# EAGLE schematic Octal (EAGLE 9.4.1)

## Sheet 1 of 6
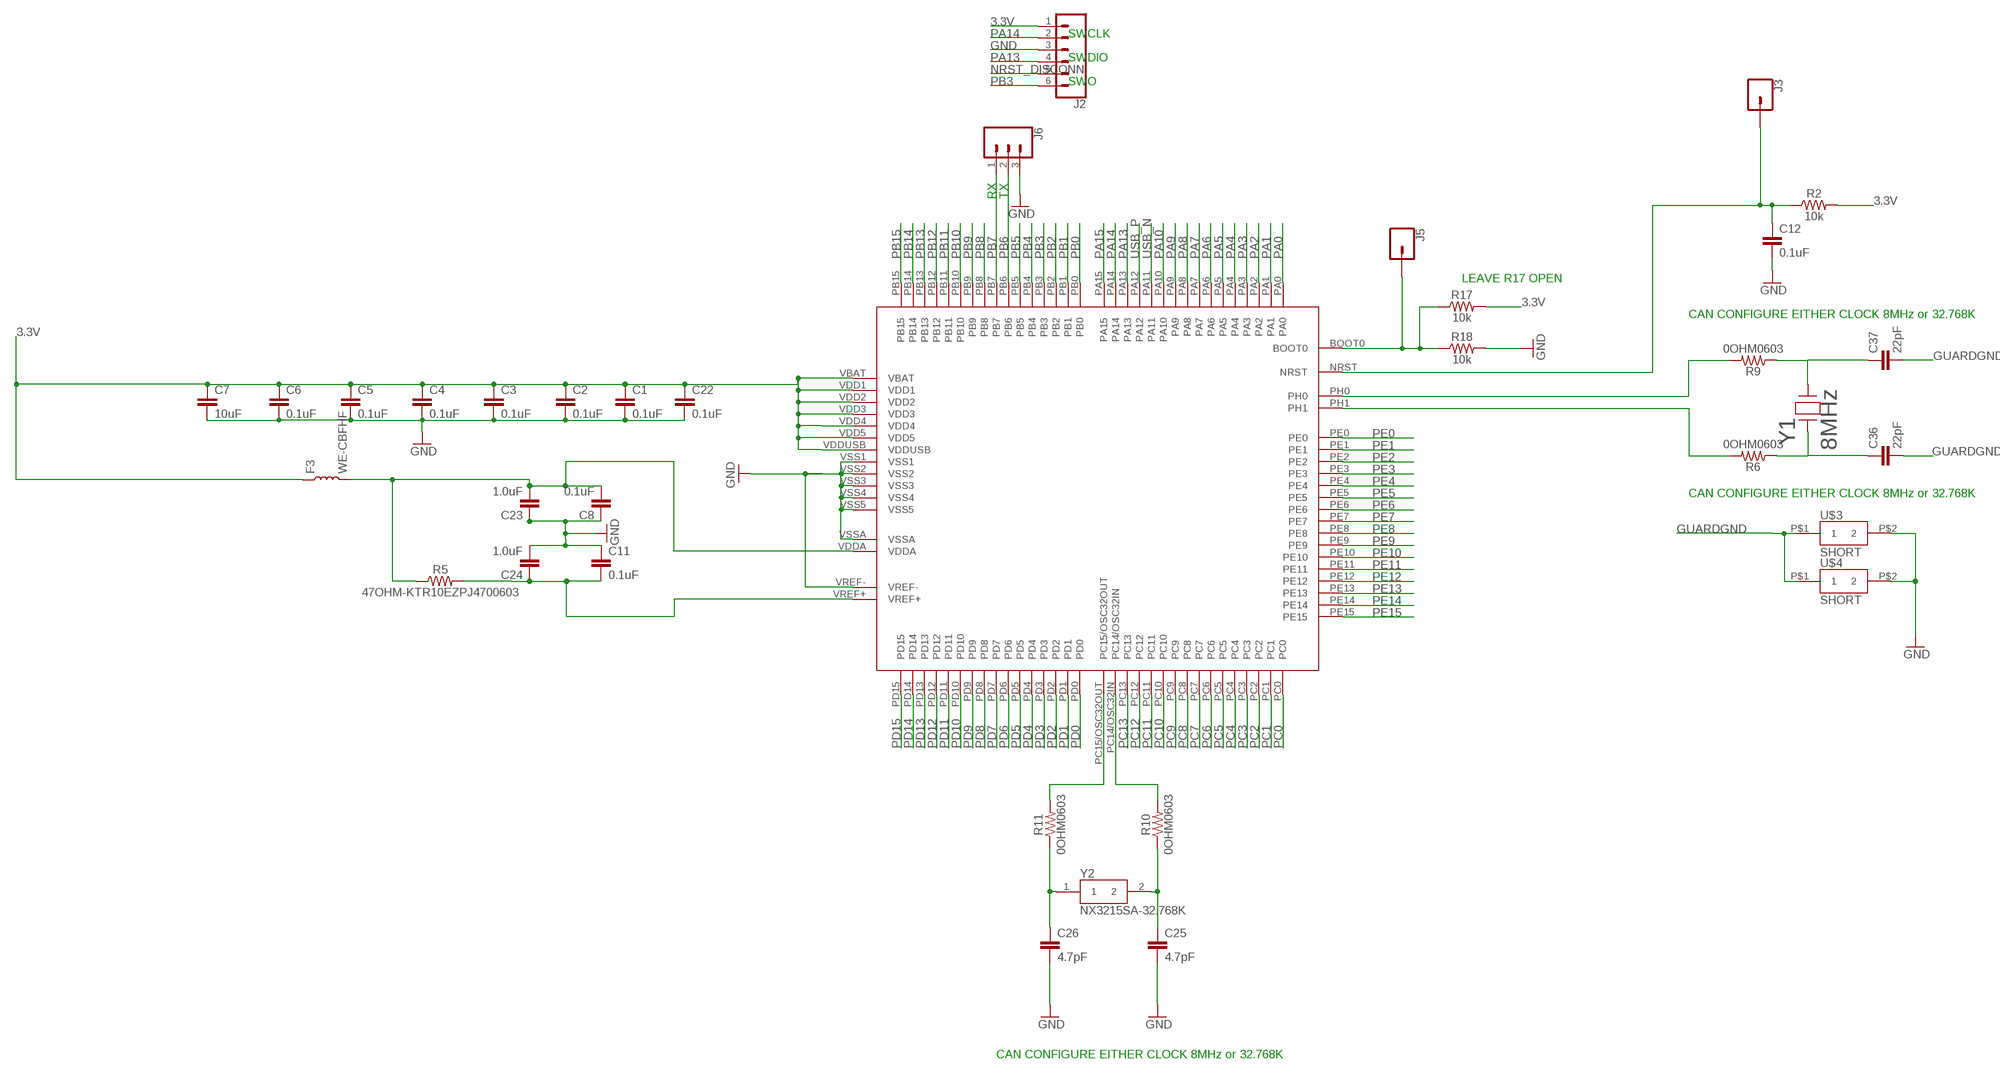
[diagram p0: schematic, sheet 1]

### Parts
C1  0.1uF  0.1UF-0603-25V-5%  [0603]
C2  0.1uF  0.1UF-0603-25V-5%  [0603]
C3  0.1uF  0.1UF-0603-25V-5%  [0603]
C4  0.1uF  0.1UF-0603-25V-5%  [0603]
C5  0.1uF  0.1UF-0603-25V-5%  [0603]
C6  0.1uF  0.1UF-0603-25V-5%  [0603]
C7  10uF  10UF-0603-6.3V-20%  [0603]
C8  0.1uF  0.1UF-0603-25V-5%  [0603]
C11  0.1uF  0.1UF-0603-25V-5%  [0603]
C12  0.1uF  0.1UF-0603-25V-5%  [0603]
C22  0.1uF  0.1UF-0603-25V-5%  [0603]
C23  1.0uF  1.0UF-0603-16V-10%  [0603]
C24  1.0uF  1.0UF-0603-16V-10%  [0603]
C25  4.7pF  22PF-0603-50V-5%  [0603]
C26  4.7pF  22PF-0603-50V-5%  [0603]
C36  22pF  22PF-0603-50V-5%  [0603]
C37  22pF  22PF-0603-50V-5%  [0603]
F3  WE-CBFHF  [0603]
J2  CONN_06SILK_FEMALE_PTH  [1X06]
J3  CONN_01  [1X01]
J5  CONN_01  [1X01]
J6  CONN_03  [1X03]
R2  10k  10KOHM-0603-1/10W-1%  [0603]
R5  47OHM-KTR10EZPJ4700603  [0603]
R6  0OHM0603  [0603]
R9  0OHM0603  [0603]
R10  0OHM0603  [0603]
R11  0OHM0603  [0603]
R17  10k  10KOHM-0603-1/10W-1%  [0603]
R18  10k  10KOHM-0603-1/10W-1%  [0603]
U5  STM32L476VGT6  [STM32L4_LQFP100]
U$3  SHORT  [SHORT]
U$4  SHORT  [SHORT]
Y1  8MHz  FOXSDLF/080-20  [CRYSTAL_HC49SDLF]
Y2  NX3215SA-32.768K  NX3215SA-32.768K-EXS00A-MU0000  [NX3215SA32768KEXS00AMU00003]

### Nets
3.3V: C1.1 C2.1 C3.1 C4.1 C5.1 C6.1 C7.1 C22.1 F3.1 J2.1 R2.2 R17.2 U5.VBAT U5.VDD1 U5.VDD2 U5.VDD3 U5.VDD4 U5.VDD5 U5.VDDUSB ; also sheet 2,3,4,5,6
BOOT0: J5.1 R17.1 R18.1 U5.BOOT0
GND [ground]: C1.2 C2.2 C3.2 C4.2 C5.2 C6.2 C7.2 C8.1 C11.1 C12.2 C22.2 C23.1 C24.2 C25.2 C26.2 J2.3 J6.3 R18.2 U5.VREF- U5.VSS1 U5.VSS2 U5.VSS3 U5.VSS4 U5.VSS5 U5.VSSA U$3.P$2 U$4.P$2 ; also sheet 2,3,4,5
GUARDGND: C36.2 C37.2 U$3.P$1 U$4.P$1
N$1: C8.2 C23.2 F3.2 R5.1 U5.VDDA
N$2 [ground]: C11.2 C24.1 R5.2 U5.VREF+
N$8: R9.2 U5.PH0
N$13: C37.1 R9.1 Y1.2
N$14: C36.1 R6.1 Y1.1
N$17: R6.2 U5.PH1
N$18: C26.1 R11.1 Y2.1
N$19: C25.1 R10.1 Y2.2
N$20: R11.2 U5.PC15/OSC32OUT
N$21: R10.2 U5.PC14/OSC32IN
NRST1: C12.1 J3.1 R2.1 U5.NRST
NRST_DISCONN: J2.5
PA0: U5.PA0 ; also sheet 6
PA1: U5.PA1 ; also sheet 6
PA2: U5.PA2 ; also sheet 6
PA3: U5.PA3 ; also sheet 6
PA4: U5.PA4 ; also sheet 6
PA5: U5.PA5 ; also sheet 6
PA6: U5.PA6 ; also sheet 6
PA7: U5.PA7 ; also sheet 6
PA8: U5.PA8 ; also sheet 6
PA9: U5.PA9 ; also sheet 6
PA10: U5.PA10 ; also sheet 6
PA13: J2.4 U5.PA13
PA14: J2.2 U5.PA14
PA15: U5.PA15 ; also sheet 6
PB0: U5.PB0 ; also sheet 6
PB1: U5.PB1 ; also sheet 6
PB2: U5.PB2 ; also sheet 6
PB3: J2.6 U5.PB3
PB4: U5.PB4 ; also sheet 4
PB5: U5.PB5
PB6: J6.2 U5.PB6
PB7: J6.1 U5.PB7
PB8: U5.PB8
PB9: U5.PB9
PB10: U5.PB10 ; also sheet 5
PB11: U5.PB11 ; also sheet 5
PB12: U5.PB12 ; also sheet 6
PB13: U5.PB13 ; also sheet 6
PB14: U5.PB14 ; also sheet 5
PB15: U5.PB15 ; also sheet 5
PC0: U5.PC0 ; also sheet 6
PC1: U5.PC1 ; also sheet 6
PC2: U5.PC2 ; also sheet 6
PC3: U5.PC3 ; also sheet 6
PC4: U5.PC4 ; also sheet 6
PC5: U5.PC5 ; also sheet 6
PC6: U5.PC6 ; also sheet 6
PC7: U5.PC7 ; also sheet 6
PC8: U5.PC8 ; also sheet 6
PC9: U5.PC9 ; also sheet 6
PC10: U5.PC10 ; also sheet 6
PC11: U5.PC11 ; also sheet 4
PC12: U5.PC12 ; also sheet 6
PC13: U5.PC13
PD0: U5.PD0 ; also sheet 6
PD1: U5.PD1 ; also sheet 6
PD2: U5.PD2 ; also sheet 6
PD3: U5.PD3 ; also sheet 6
PD4: U5.PD4 ; also sheet 6
PD5: U5.PD5 ; also sheet 6
PD6: U5.PD6 ; also sheet 6
PD7: U5.PD7 ; also sheet 6
PD8: U5.PD8 ; also sheet 6
PD9: U5.PD9 ; also sheet 6
PD10: U5.PD10 ; also sheet 6
PD11: U5.PD11 ; also sheet 3
PD12: U5.PD12 ; also sheet 6
PD13: U5.PD13 ; also sheet 6
PD14: U5.PD14 ; also sheet 6
PD15: U5.PD15 ; also sheet 6
PE0: U5.PE0 ; also sheet 4
PE1: U5.PE1 ; also sheet 5
PE2: U5.PE2 ; also sheet 6
PE3: U5.PE3 ; also sheet 6
PE4: U5.PE4 ; also sheet 6
PE5: U5.PE5 ; also sheet 6
PE6: U5.PE6 ; also sheet 6
PE7: U5.PE7 ; also sheet 6
PE8: U5.PE8 ; also sheet 5
PE9: U5.PE9 ; also sheet 2
PE10: U5.PE10 ; also sheet 2
PE11: U5.PE11 ; also sheet 2
PE12: U5.PE12 ; also sheet 2
PE13: U5.PE13 ; also sheet 2,4
PE14: U5.PE14 ; also sheet 2
PE15: U5.PE15 ; also sheet 2,4
USB_N: U5.PA11 ; also sheet 3
USB_P: U5.PA12 ; also sheet 3

### Notes on the sheet
- SWCLK
- SWDIO
- SWO
- RX | TX
- LEAVE R17 OPEN
- CAN CONFIGURE EITHER CLOCK 8MHz or 32.768K
- CAN CONFIGURE EITHER CLOCK 8MHz or 32.768K
- CAN CONFIGURE EITHER CLOCK 8MHz or 32.768K

## Sheet 2 of 6
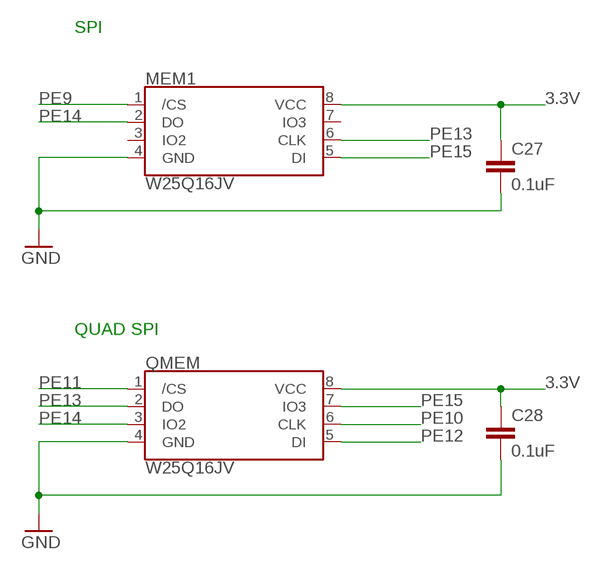
[diagram p1: schematic, sheet 2]

### Parts
C27  0.1uF  0.1UF-0603-25V-5%  [0603]
C28  0.1uF  0.1UF-0603-25V-5%  [0603]
MEM1  W25Q16JV  W25Q128JV  [SOIC-8]
QMEM  W25Q16JV  W25Q128JV  [SOIC-8]

### Nets
3.3V: C27.1 C28.1 MEM1.8(VCC) QMEM.8(VCC) ; also sheet 1,3,4,5,6
GND [ground]: C27.2 C28.2 MEM1.4(GND) QMEM.4(GND) ; also sheet 1,3,4,5
PE9: MEM1.1(/CS) ; also sheet 1
PE10: QMEM.6(CLK) ; also sheet 1
PE11: QMEM.1(/CS) ; also sheet 1
PE12: QMEM.5(DI) ; also sheet 1
PE13: MEM1.6(CLK) QMEM.2(DO) ; also sheet 1,4
PE14: MEM1.2(DO) QMEM.3(IO2) ; also sheet 1
PE15: MEM1.5(DI) QMEM.7(IO3) ; also sheet 1,4
Unconnected: MEM1.3(IO2) MEM1.7(IO3)

### Notes on the sheet
- SPI
- QUAD SPI

## Sheet 3 of 6
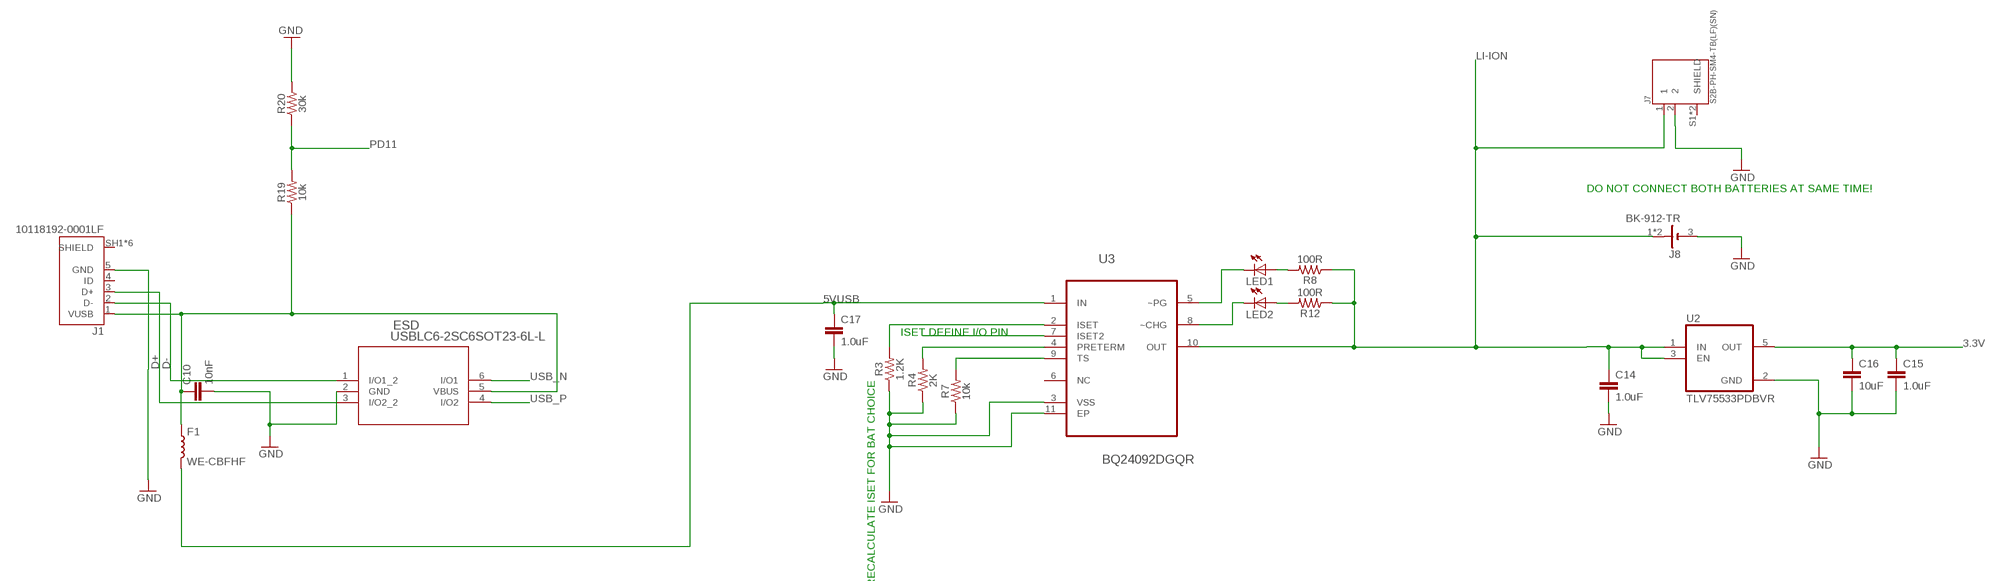
[diagram p2: schematic, sheet 3]

### Parts
C10  10nF  10NF-0603-50V-10%  [0603]
C14  1.0uF  SPARKFUN-CAPACITORS_1.0UF-0603-16V-10%  [SPARKFUN-CAPACITORS_0603]
C15  1.0uF  SPARKFUN-CAPACITORS_1.0UF-0603-16V-10%  [SPARKFUN-CAPACITORS_0603]
C16  10uF  10UF-0603-6.3V-20%  [0603]
C17  1.0uF  SPARKFUN-CAPACITORS_1.0UF-0603-16V-10%  [SPARKFUN-CAPACITORS_0603]
ESD  USBLC6-2SC6SOT23-6L-L  [SOT23-6L-L]
F1  WE-CBFHF  [0603]
J1  10118192-0001LF  [AMPHENOL_10118192-0001LF]
J7  S2B-PH-SM4-TB(LF)(SN)  [JST_S2B-PH-SM4-TB(LF)(SN)]
J8  BK-912-TR  [MPD_BK-912-TR]
LED1  LEDCHIP-LED0603  [CHIP-LED0603]
LED2  LEDCHIP-LED0603  [CHIP-LED0603]
R3  1.2K  SPARKFUN-RESISTORS_10KOHM-0603-1/10W-1%  [SPARKFUN-RESISTORS_0603:1]
R4  2K  SPARKFUN-RESISTORS_10KOHM-0603-1/10W-1%  [SPARKFUN-RESISTORS_0603:1]
R7  10k  SPARKFUN-RESISTORS_10KOHM-0603-1/10W-1%  [SPARKFUN-RESISTORS_0603:1]
R8  100R  SPARKFUN-RESISTORS_10KOHM-0603-1/10W-1%  [SPARKFUN-RESISTORS_0603:1]
R12  100R  SPARKFUN-RESISTORS_10KOHM-0603-1/10W-1%  [SPARKFUN-RESISTORS_0603:1]
R19  10k  SPARKFUN-RESISTORS_10KOHM-0603-1/10W-1%  [SPARKFUN-RESISTORS_0603:1]
R20  30k  SPARKFUN-RESISTORS_10KOHM-0603-1/10W-1%  [SPARKFUN-RESISTORS_0603:1]
U2  TLV75533PDBVR  [SOT95P280X145-5N]
U3  BQ24092DGQR  [SOP50P490X110-11N]

### Nets
3.3V: C15.1 C16.1 U2.5(OUT) ; also sheet 1,2,4,5,6
5VUSB [linear regulators]: C17.1 F1.2 U3.1(IN)
D+: ESD.3(I/O2_2) J1.3(D+)
D-: ESD.1(I/O1_2) J1.2(D-)
GND [ground]: C10.2 C14.2 C15.2 C16.2 C17.2 ESD.2(GND) J1.5(GND) J7.2 J8.3(-) R3.1 R4.1 R7.1 R20.2 U2.2(GND) U3.3(VSS) U3.11(EP) ; also sheet 1,2,4,5
LI-ION [linear regulators]: C14.1 J7.1 J8.1(+) J8.2(+) R8.1 R12.1 U2.1(IN) U2.3(EN) U3.10(OUT)
N$6: R3.2 U3.2(ISET)
N$7: U3.7(ISET2)
N$10: R7.2 U3.9(TS)
N$11: R4.2 U3.4(PRETERM)
N$12: LED1.C U3.5(~PG)
N$22: LED2.C U3.8(~CHG)
N$24: LED1.A R8.2
N$25: LED2.A R12.2
PD11: R19.2 R20.1 ; also sheet 1
USB_N: ESD.6(I/O1) ; also sheet 1
USB_P: ESD.4(I/O2) ; also sheet 1
VBUS: C10.1 ESD.5(VBUS) F1.1 J1.1(VUSB) R19.1
Unconnected: J1.4(ID) J1.SH1(SHIELD) J1.SH2(SHIELD) J1.SH3(SHIELD) J1.SH4(SHIELD) J1.SH5(SHIELD) J1.SH6(SHIELD) J7.S1(SHIELD) J7.S2(SHIELD) U3.6(NC)

### Notes on the sheet
- DO NOT CONNECT BOTH BATTERIES AT SAME TIME!
- ISET DEFINE I/O PIN
- RECALCULATE ISET FOR BAT CHOICE

## Sheet 4 of 6
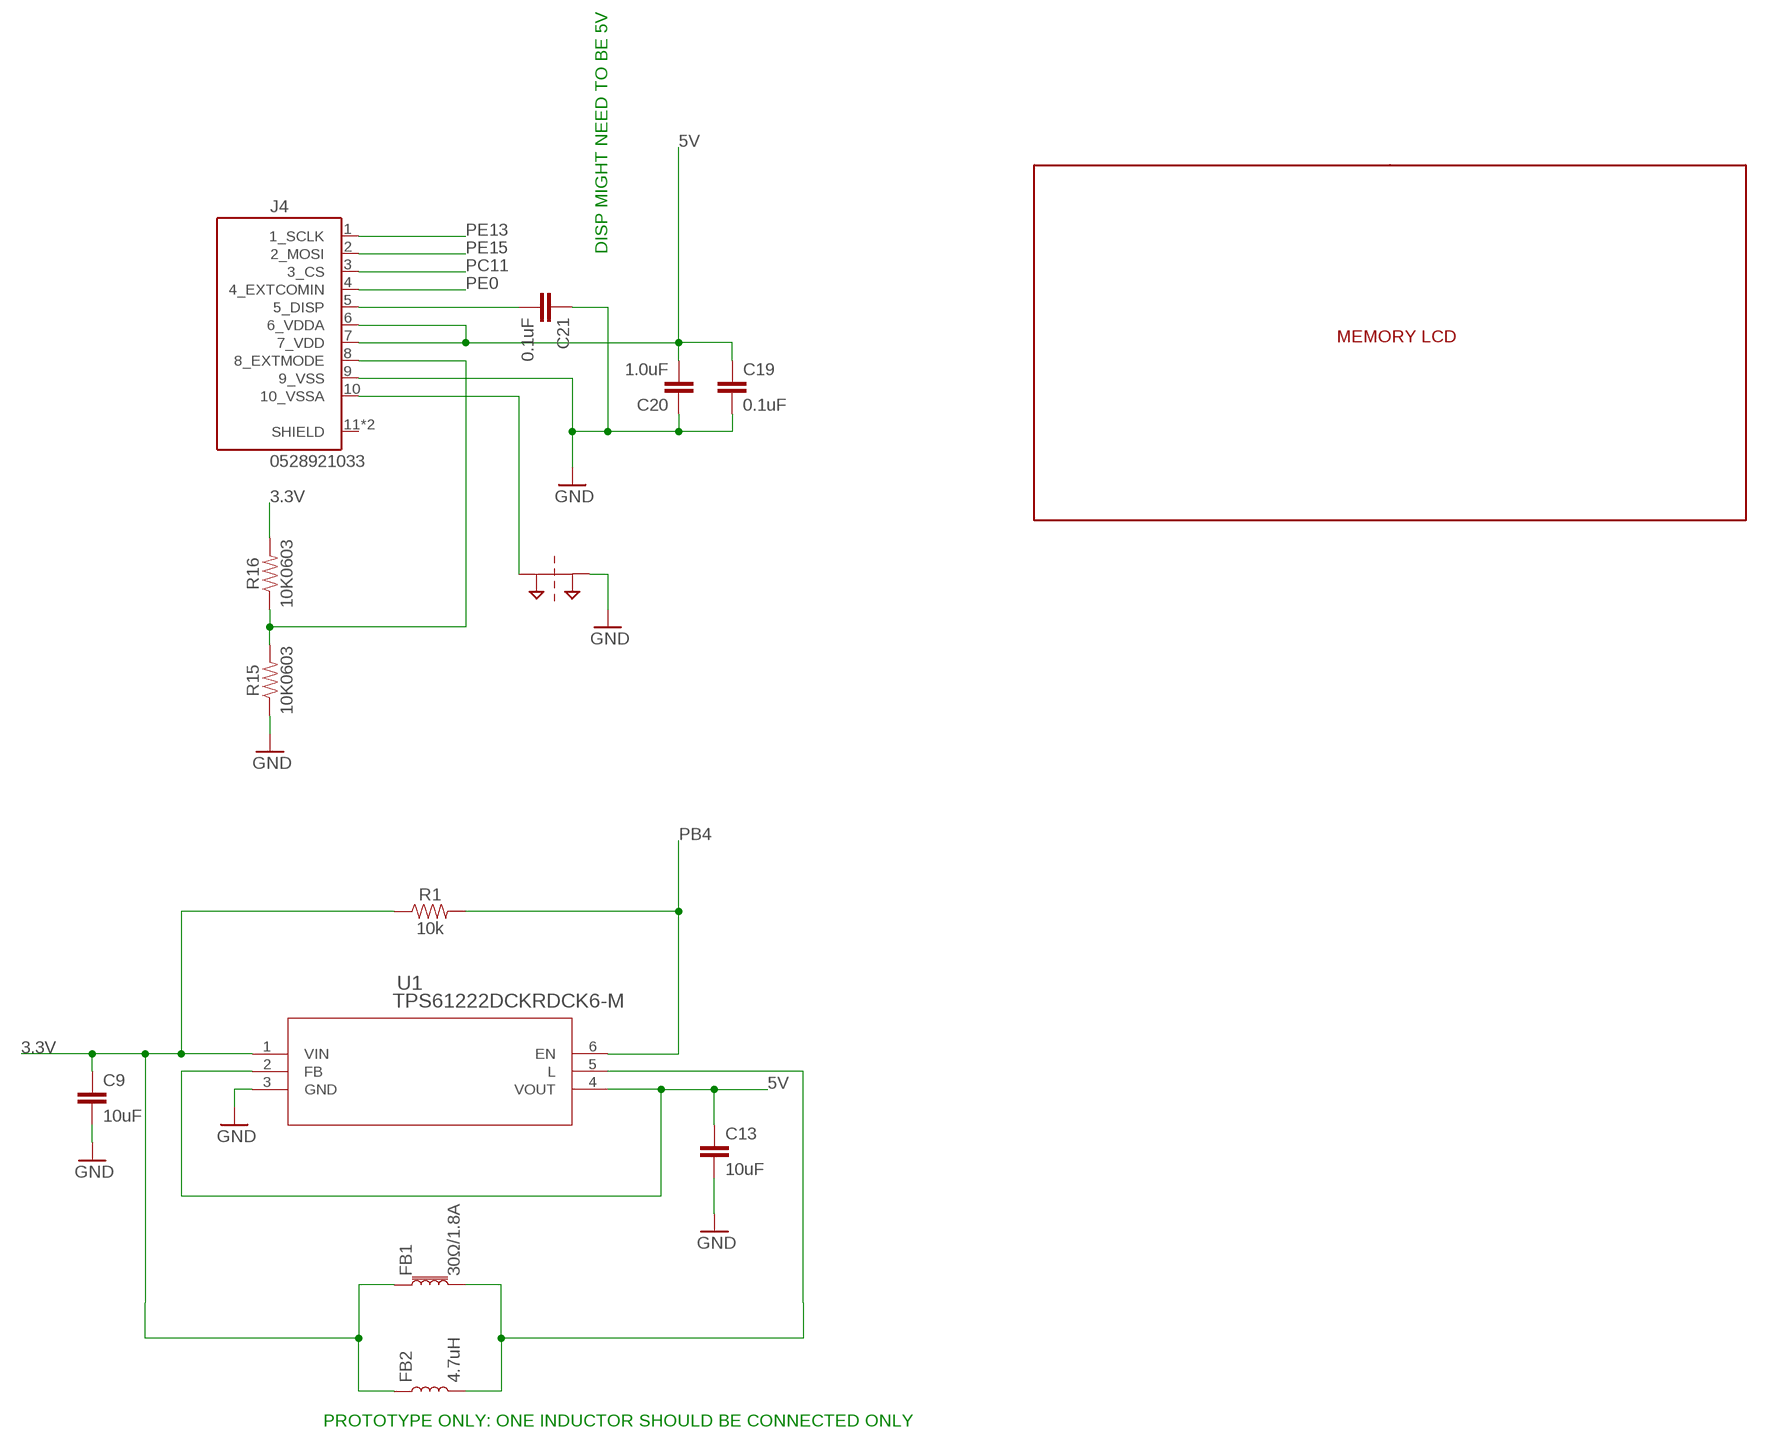
[diagram p3: schematic, sheet 4]

### Parts
C9  10uF  10UF-0603-6.3V-20%  [0603]
C13  10uF  10UF-0603-6.3V-20%  [0603]
C19  0.1uF  0.1UF-0603-25V-5%  [0603]
C20  1.0uF  1.0UF-0603-16V-10%  [0603]
C21  0.1uF  0.1UF-0603-25V-5%  [0603]
FB1  30Ω/1.8A  FERRITE_BEAD-0603  [0603]
FB2  4.7uH  CIG22H4R7MNE  [CIG22H4R7MNE]
J4  0528921033  [MOLEX_0528921033]
R1  10k  SPARKFUN-RESISTORS_10KOHM-0603-1/10W-1%  [SPARKFUN-RESISTORS_0603:1]
R15  10K0603  [0603]
R16  10K0603  [0603]
SUPPLY1  2PT_GND_TIE  [2PT_GND_TIE]
U1  TPS61222DCKRDCK6-M  [DCK6-M]
U$2  LS027B7DH01  [LS027B7DH01]

### Nets
3.3V: C9.1 FB1.1 FB2.1 R1.1 R16.2 U1.1(VIN) ; also sheet 1,2,3,5,6
5V: C13.1 C19.1 C20.2 J4.6(6_VDDA) J4.7(7_VDD) U1.2(FB) U1.4(VOUT)
ARTN [ground]: J4.10(10_VSSA) SUPPLY1.P$1
GND [ground]: C9.2 C13.2 C19.2 C20.1 C21.1 J4.9(9_VSS) R15.1 SUPPLY1.P$2 U1.3(GND) ; also sheet 1,2,3,5
N$5: FB1.2 FB2.2 U1.5(L)
N$39: C21.2 J4.5(5_DISP)
N$42: J4.8(8_EXTMODE) R15.2 R16.1
PB4: R1.2 U1.6(EN) ; also sheet 1
PC11: J4.3(3_CS) ; also sheet 1
PE0: J4.4(4_EXTCOMIN) ; also sheet 1
PE13: J4.1(1_SCLK) ; also sheet 1,2
PE15: J4.2(2_MOSI) ; also sheet 1,2
Unconnected: J4.11(SHIELD) J4.12(SHIELD)

### Notes on the sheet
- DISP MIGHT NEED TO BE 5V
- PROTOTYPE ONLY: ONE INDUCTOR SHOULD BE CONNECTED ONLY

## Sheet 5 of 6
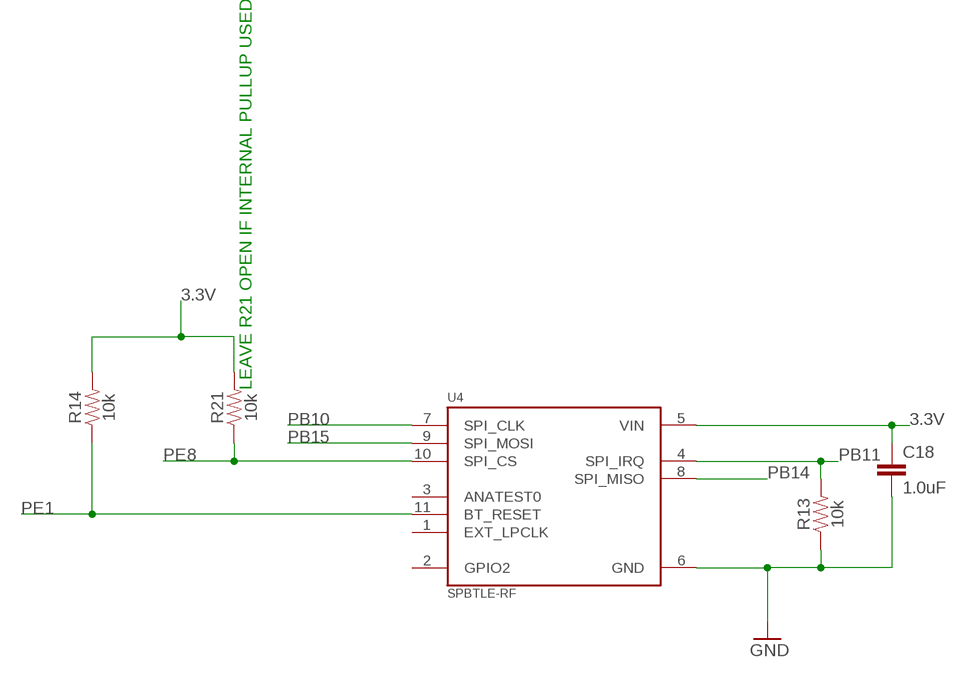
[diagram p4: schematic, sheet 5]

### Parts
C18  1.0uF  SPARKFUN-CAPACITORS_1.0UF-0603-16V-10%  [SPARKFUN-CAPACITORS_0603]
R13  10k  SPARKFUN-RESISTORS_10KOHM-0603-1/10W-1%  [SPARKFUN-RESISTORS_0603:1]
R14  10k  SPARKFUN-RESISTORS_10KOHM-0603-1/10W-1%  [SPARKFUN-RESISTORS_0603:1]
R21  10k  SPARKFUN-RESISTORS_10KOHM-0603-1/10W-1%  [SPARKFUN-RESISTORS_0603:1]
U4  SPBTLE-RF  [XCVR_SPBTLE-RF]

### Nets
3.3V: C18.1 R14.2 R21.2 U4.5(VIN) ; also sheet 1,2,3,4,6
GND [ground]: C18.2 R13.1 U4.6(GND) ; also sheet 1,2,3,4
PB10: U4.7(SPI_CLK) ; also sheet 1
PB11: R13.2 U4.4(SPI_IRQ) ; also sheet 1
PB14: U4.8(SPI_MISO) ; also sheet 1
PB15: U4.9(SPI_MOSI) ; also sheet 1
PE1: R14.1 U4.11(BT_RESET) ; also sheet 1
PE8: R21.1 U4.10(SPI_CS) ; also sheet 1
Unconnected: U4.1(EXT_LPCLK) U4.2(GPIO2) U4.3(ANATEST0)

### Notes on the sheet
- LEAVE R21 OPEN IF INTERNAL PULLUP USED

## Sheet 6 of 6
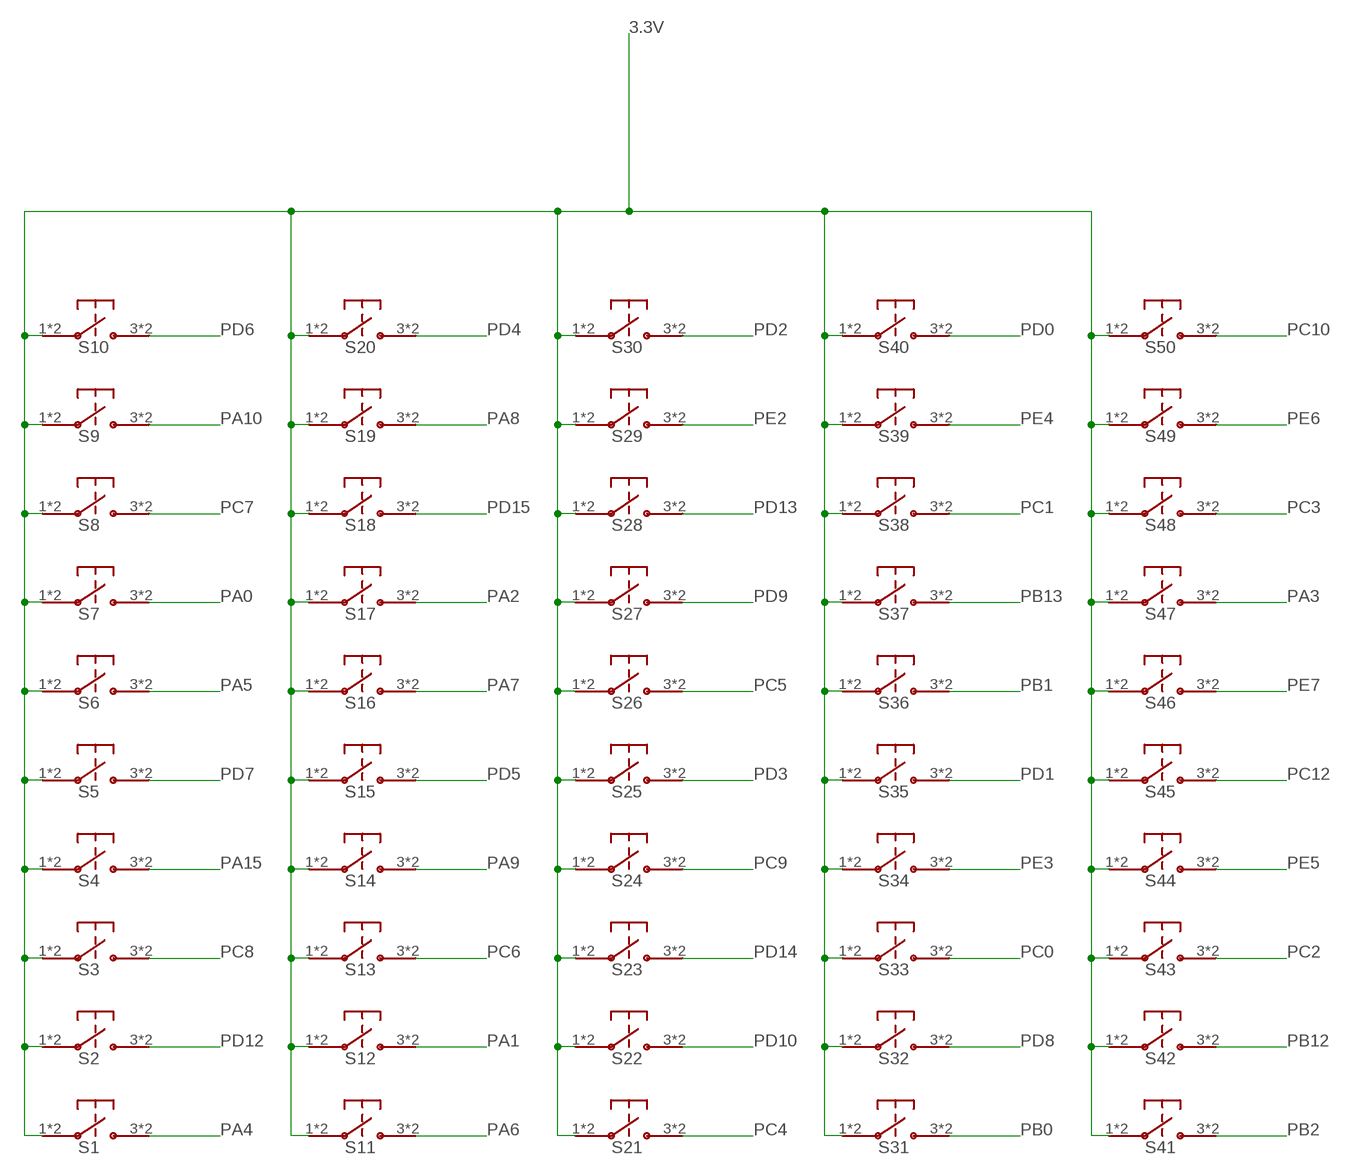
[diagram p5: schematic, sheet 6]

### Parts
S1  TL3315NF100Q  [TL3315NF100Q]
S2  TL3315NF100Q  [TL3315NF100Q]
S3  TL3315NF100Q  [TL3315NF100Q]
S4  TL3315NF100Q  [TL3315NF100Q]
S5  TL3315NF100Q  [TL3315NF100Q]
S6  TL3315NF100Q  [TL3315NF100Q]
S7  TL3315NF100Q  [TL3315NF100Q]
S8  TL3315NF100Q  [TL3315NF100Q]
S9  TL3315NF100Q  [TL3315NF100Q]
S10  TL3315NF100Q  [TL3315NF100Q]
S11  TL3315NF100Q  [TL3315NF100Q]
S12  TL3315NF100Q  [TL3315NF100Q]
S13  TL3315NF100Q  [TL3315NF100Q]
S14  TL3315NF100Q  [TL3315NF100Q]
S15  TL3315NF100Q  [TL3315NF100Q]
S16  TL3315NF100Q  [TL3315NF100Q]
S17  TL3315NF100Q  [TL3315NF100Q]
S18  TL3315NF100Q  [TL3315NF100Q]
S19  TL3315NF100Q  [TL3315NF100Q]
S20  TL3315NF100Q  [TL3315NF100Q]
S21  TL3315NF100Q  [TL3315NF100Q]
S22  TL3315NF100Q  [TL3315NF100Q]
S23  TL3315NF100Q  [TL3315NF100Q]
S24  TL3315NF100Q  [TL3315NF100Q]
S25  TL3315NF100Q  [TL3315NF100Q]
S26  TL3315NF100Q  [TL3315NF100Q]
S27  TL3315NF100Q  [TL3315NF100Q]
S28  TL3315NF100Q  [TL3315NF100Q]
S29  TL3315NF100Q  [TL3315NF100Q]
S30  TL3315NF100Q  [TL3315NF100Q]
S31  TL3315NF100Q  [TL3315NF100Q]
S32  TL3315NF100Q  [TL3315NF100Q]
S33  TL3315NF100Q  [TL3315NF100Q]
S34  TL3315NF100Q  [TL3315NF100Q]
S35  TL3315NF100Q  [TL3315NF100Q]
S36  TL3315NF100Q  [TL3315NF100Q]
S37  TL3315NF100Q  [TL3315NF100Q]
S38  TL3315NF100Q  [TL3315NF100Q]
S39  TL3315NF100Q  [TL3315NF100Q]
S40  TL3315NF100Q  [TL3315NF100Q]
S41  TL3315NF100Q  [TL3315NF100Q]
S42  TL3315NF100Q  [TL3315NF100Q]
S43  TL3315NF100Q  [TL3315NF100Q]
S44  TL3315NF100Q  [TL3315NF100Q]
S45  TL3315NF100Q  [TL3315NF100Q]
S46  TL3315NF100Q  [TL3315NF100Q]
S47  TL3315NF100Q  [TL3315NF100Q]
S48  TL3315NF100Q  [TL3315NF100Q]
S49  TL3315NF100Q  [TL3315NF100Q]
S50  TL3315NF100Q  [TL3315NF100Q]

### Nets
3.3V: S1.1 S1.2 S2.1 S2.2 S3.1 S3.2 S4.1 S4.2 S5.1 S5.2 S6.1 S6.2 S7.1 S7.2 S8.1 S8.2 S9.1 S9.2 S10.1 S10.2 S11.1 S11.2 S12.1 S12.2 S13.1 S13.2 S14.1 S14.2 S15.1 S15.2 S16.1 S16.2 S17.1 S17.2 S18.1 S18.2 S19.1 S19.2 S20.1 S20.2 S21.1 S21.2 S22.1 S22.2 S23.1 S23.2 S24.1 S24.2 S25.1 S25.2 S26.1 S26.2 S27.1 S27.2 S28.1 S28.2 S29.1 S29.2 S30.1 S30.2 S31.1 S31.2 S32.1 S32.2 S33.1 S33.2 S34.1 S34.2 S35.1 S35.2 S36.1 S36.2 S37.1 S37.2 S38.1 S38.2 S39.1 S39.2 S40.1 S40.2 S41.1 S41.2 S42.1 S42.2 S43.1 S43.2 S44.1 S44.2 S45.1 S45.2 S46.1 S46.2 S47.1 S47.2 S48.1 S48.2 S49.1 S49.2 S50.1 S50.2 ; also sheet 1,2,3,4,5
PA0: S7.3 S7.4 ; also sheet 1
PA1: S12.3 S12.4 ; also sheet 1
PA2: S17.3 S17.4 ; also sheet 1
PA3: S47.3 S47.4 ; also sheet 1
PA4: S1.3 S1.4 ; also sheet 1
PA5: S6.3 S6.4 ; also sheet 1
PA6: S11.3 S11.4 ; also sheet 1
PA7: S16.3 S16.4 ; also sheet 1
PA8: S19.3 S19.4 ; also sheet 1
PA9: S14.3 S14.4 ; also sheet 1
PA10: S9.3 S9.4 ; also sheet 1
PA15: S4.3 S4.4 ; also sheet 1
PB0: S31.3 S31.4 ; also sheet 1
PB1: S36.3 S36.4 ; also sheet 1
PB2: S41.3 S41.4 ; also sheet 1
PB12: S42.3 S42.4 ; also sheet 1
PB13: S37.3 S37.4 ; also sheet 1
PC0: S33.3 S33.4 ; also sheet 1
PC1: S38.3 S38.4 ; also sheet 1
PC2: S43.3 S43.4 ; also sheet 1
PC3: S48.3 S48.4 ; also sheet 1
PC4: S21.3 S21.4 ; also sheet 1
PC5: S26.3 S26.4 ; also sheet 1
PC6: S13.3 S13.4 ; also sheet 1
PC7: S8.3 S8.4 ; also sheet 1
PC8: S3.3 S3.4 ; also sheet 1
PC9: S24.3 S24.4 ; also sheet 1
PC10: S50.3 S50.4 ; also sheet 1
PC12: S45.3 S45.4 ; also sheet 1
PD0: S40.3 S40.4 ; also sheet 1
PD1: S35.3 S35.4 ; also sheet 1
PD2: S30.3 S30.4 ; also sheet 1
PD3: S25.3 S25.4 ; also sheet 1
PD4: S20.3 S20.4 ; also sheet 1
PD5: S15.3 S15.4 ; also sheet 1
PD6: S10.3 S10.4 ; also sheet 1
PD7: S5.3 S5.4 ; also sheet 1
PD8: S32.3 S32.4 ; also sheet 1
PD9: S27.3 S27.4 ; also sheet 1
PD10: S22.3 S22.4 ; also sheet 1
PD12: S2.3 S2.4 ; also sheet 1
PD13: S28.3 S28.4 ; also sheet 1
PD14: S23.3 S23.4 ; also sheet 1
PD15: S18.3 S18.4 ; also sheet 1
PE2: S29.3 S29.4 ; also sheet 1
PE3: S34.3 S34.4 ; also sheet 1
PE4: S39.3 S39.4 ; also sheet 1
PE5: S44.3 S44.4 ; also sheet 1
PE6: S49.3 S49.4 ; also sheet 1
PE7: S46.3 S46.4 ; also sheet 1

## Library data of the parts
C1-C6 C8 C11 C12 C19 C21 C22 C27 C28 = SparkFun-Capacitors:0.1UF: 0.1µF ceramic capacitors A capacitor is a passive two-terminal electrical component used to store electrical energy temporarily in an electric field.; PROD_ID: CAP-08604
C7 = SparkFun-Capacitors:10UF: 10.0µF ceramic capacitors A capacitor is a passive two-terminal electrical component used to store electrical energy temporarily in an electric field.; PROD_ID: CAP-11015
C9 C13 C16 = Octal:10UF: 10.0µF ceramic capacitors A capacitor is a passive two-terminal electrical component used to store electrical energy temporarily in an electric field.; PROD_ID: CAP-11015
C10 = SparkFun-Capacitors:10NF: 0.01uF/10nF/10,000pF ceramic capacitors A capacitor is a passive two-terminal electrical component used to store electrical energy temporarily in an electric field. CAP-09321; PROD_ID: CAP-00867
C14 C15 C17 C18 = Octal:SPARKFUN-CAPACITORS_1.0UF: 1µF ceramic capacitors A capacitor is a passive two-terminal electrical component used to store electrical energy temporarily in an electric field.; PROD_ID: CAP-00868
C20 C23 C24 = SparkFun-Capacitors:1.0UF: 1µF ceramic capacitors A capacitor is a passive two-terminal electrical component used to store electrical energy temporarily in an electric field.; PROD_ID: CAP-00868
C25 C26 = SparkFun-Capacitors:22PF: 22pF ceramic capacitors A capacitor is a passive two-terminal electrical component used to store electrical energy temporarily in an electric field.; PROD_ID: CAP-07876; VALUE: 22pF
C36 C37 = SparkFun-Capacitors:22PF: 22pF ceramic capacitors A capacitor is a passive two-terminal electrical component used to store electrical energy temporarily in an electric field.; PROD_ID: CAP-07876
ESD = scottohair Tantalum:USBLC6-2SC6; MANUFACTURER_PART_NUMBER: USBLC62SC6; VENDOR: STMicroelectronics
F1 F3 = scottohair Tantalum:WE-CBFHF
FB1 = SparkFun-Coils:FERRITE_BEAD: Ferrite Bead (blocks, cores, rings, chokes, etc.) Inductor with layers of ferrite used to suppress high frequencies. Often used to isolate high frequency noise. SparkFun Products: IOIO-OTG - V2.2 <https://www.sparkfun.com/products/13613> SparkFun SAMD21 Mini Breakout <https://www.sparkfun.com/products/13664> SparkFun 6 Degrees of Freedom Breakout - LSM6DS3 <https://www.sparkfun.com/products/13339> SparkFun SAMD21 Dev Breakout <https://www.sparkfun.com/products/13672>; PROD_ID: NDUC-07859
FB2 = Octal:CIG22H4R7MNE
J1 = Octal:10118192-0001LF: Single Port 5 Contact Horizontal Right Angle Shielded Micro B USB 2.0 Connector; AVAILABILITY: Unavailable; DESCRIPTION: Single Port 5 Contact Horizontal Right Angle Shielded Micro B USB 2.0 Connector; MF: Amphenol ICC; MP: 10118192-0001LF; PACKAGE: None; PRICE: None
J2 = SparkFun-Connectors:CONN_06: Multi connection point. Often used as Generic Header-pin footprint for 0.1 inch spaced/style header connections On any of the 0.1 inch spaced packages, you can populate with these: Break Away Headers - Straight <https://www.sparkfun.com/products/116> (PRT-00116) Break Away Male Headers - Right Angle <https://www.sparkfun.com/products/553> (PRT-00553) Female Headers <https://www.sparkfun.com/products/115> (PRT-00115) Break Away Headers - Machine Pin <https://www.sparkfun.com/products/117> (PRT-00117) Break Away Female Headers - Swiss Machine Pin <https://www.sparkfun.com/products/743> (PRT-00743) Arduino Stackable Header - 6 Pin <https://www.sparkfun.com/products/9280> (PRT-09280) For SCREWTERMINALS and SPRING TERMINALS visit here: Screw Terimnals on SparkFun.com <https://www.sparkfun.com/search/results?term=Screw+Terminals> (5mm/3.5mm/2.54mm spacing) This device is also useful as a general connection point to wire up your design to another part of your project. Our various solder wires solder well into these plated through hole pads. Hook-Up Wire - Assortment (Stranded, 22 AWG) <https://www.sparkfun.com/products/11375> (PRT-11375) Hook-Up Wire - Assortment (Solid Core, 22 AWG) <https://www.sparkfun.com/products/11367> (PRT-11367) View the entire wire category on our website here <https://www.sparkfun.com/categories/141>; PROD_ID: CONN-08437
J3 J5 = SparkFun-Connectors:CONN_01: Single connection point. Often used as Generic Header-pin footprint for 0.1 inch spaced/style header connections On any of the 0.1 inch spaced packages, you can populate with these: Break Away Headers - Straight <https://www.sparkfun.com/products/116> (PRT-00116) Break Away Male Headers - Right Angle <https://www.sparkfun.com/products/553> (PRT-00553) Female Headers <https://www.sparkfun.com/products/115> (PRT-00115) Break Away Headers - Machine Pin <https://www.sparkfun.com/products/117> (PRT-00117) Break Away Female Headers - Swiss Machine Pin <https://www.sparkfun.com/products/743> (PRT-00743) This device is also useful as a general connection point to wire up your design to another part of your project. Our various solder wires solder well into these plated through hole pads. Hook-Up Wire - Assortment (Stranded, 22 AWG) <https://www.sparkfun.com/products/11375> (PRT-11375) Hook-Up Wire - Assortment (Solid Core, 22 AWG) <https://www.sparkfun.com/products/11367> (PRT-11367) View the entire wire category on our website here <https://www.sparkfun.com/categories/141> Special notes: SMTSO-256-ET is a "flush mount" nut for a 4-40 screw. We mostly use this on specialty testbeds; it is a nice way to connect hardware to your PCB at an adjustable hieght. Also note, the SNAP packages are for using a snappable style connector. We sell a baggie of snaps and they are also used on two LilyPad designs: Snap Assortment - 30 pack (male and female) <https://www.sparkfun.com/products/11347> (DEV-11347) LilyPad Arduino SimpleSnap <https://www.sparkfun.com/products/10941> (DEV-10941) LilyPad SimpleSnap Protoboard <https://www.sparkfun.com/products/10940> (DEV-10940)
J4 = Octal:0528921033: Conn FFC/FPC Connector SKT 10 POS 0.5mm Solder RA SMD Embossed T/R; AVAILABILITY: Unavailable; DESCRIPTION: Conn Ffc Bottom 10pos 0.50mm r/a; MF: Molex; MP: 0528921033; PACKAGE: None; PRICE: None
J6 = SparkFun-Connectors:CONN_03: Multi connection point. Often used as Generic Header-pin footprint for 0.1 inch spaced/style header connections On any of the 0.1 inch spaced packages, you can populate with these: Break Away Headers - Straight <https://www.sparkfun.com/products/116> (PRT-00116) Break Away Male Headers - Right Angle <https://www.sparkfun.com/products/553> (PRT-00553) Female Headers <https://www.sparkfun.com/products/115> (PRT-00115) Break Away Headers - Machine Pin <https://www.sparkfun.com/products/117> (PRT-00117) Break Away Female Headers - Swiss Machine Pin <https://www.sparkfun.com/products/743> (PRT-00743) Stackable Header - 3 Pin (Female, 0.1") <https://www.sparkfun.com/products/13875> (PRT-13875) For SCREWTERMINALS and SPRING TERMINALS visit here: Screw Terimnals on SparkFun.com <https://www.sparkfun.com/search/results?term=Screw+Terminals> (5mm/3.5mm/2.54mm spacing) This device is also useful as a general connection point to wire up your design to another part of your project. Our various solder wires solder well into these plated through hole pads. Hook-Up Wire - Assortment (Stranded, 22 AWG) <https://www.sparkfun.com/products/11375> (PRT-11375) Hook-Up Wire - Assortment (Solid Core, 22 AWG) <https://www.sparkfun.com/products/11367> (PRT-11367) View the entire wire category on our website here <https://www.sparkfun.com/categories/141> Special notes: Molex polarized connector foot print use with SKU : PRT-08232 with associated crimp pins and housings.
J7 = Octal:S2B-PH-SM4-TB(LF)(SN): PH Series 2 Position 2 mm Pitch Surface Mount Side Entry Shrouded Header; DESCRIPTION: PH Series 2 Position 2 mm Pitch Surface Mount Side Entry Shrouded Header; DIGI-KEY_PART_NUMBER: 455-1749-1-ND; DIGI-KEY_PURCHASE_URL: https://www.digikey.com/product-detail/en/jst-sales-america-inc/S2B-PH-SM4-TB_LF__SN_/455-1749-1-ND/926846?utm_source=snapeda&utm_medium=aggregator&utm_campaign=symbol; MF: JST Sales; MP: S2B-PH-SM4-TB_LF__SN_; PACKAGE: None
J8 = Octal:BK-912-TR: Holder Coin Cell 20mm Smd; AVAILABILITY: Unavailable; DESCRIPTION: Holder Coin Cell 20mm Smd; MF: MPD _Memory; MP: BK-912-TR; PACKAGE: MSOP-12 MPD; PRICE: None
LED1 LED2 = adafruit:LED: LED OSRAM: - CHIPLED LG R971, LG N971, LY N971, LG Q971, LY Q971, LO R971, LY R971 LH N974, LH R974 LS Q976, LO Q976, LY Q976 LO Q996 - Hyper CHIPLED LW Q18S LB Q993, LB Q99A, LB R99A - SideLED LS A670, LO A670, LY A670, LG A670, LP A670 LB A673, LV A673, LT A673, LW A673 LH A674 LY A675 LS A676, LA A676, LO A676, LY A676, LW A676 LS A679, LY A679, LG A679 - Hyper Micro SIDELED® LS Y876, LA Y876, LO Y876, LY Y876 LT Y87S - SmartLED LW L88C, LW L88S LB L89C, LB L89S, LG L890 LS L89K, LO L89K, LY L89K LS L896, LA L896, LO L896, LY L896 - TOPLED LS T670, LO T670, LY T670, LG T670, LP T670 LSG T670, LSP T670, LSY T670, LOP T670, LYG T670 LG T671, LOG T671, LSG T671 LB T673, LV T673, LT T673, LW T673 LH T674 LS T676, LA T676, LO T676, LY T676, LB T676, LH T676, LSB T676, LW T676 LB T67C, LV T67C, LT T67C, LS T67K, LO T67K, LY T67K, LW E67C LS E67B, LA E67B, LO E67B, LY E67B, LB E67C, LV E67C, LT E67C LW T67C LS T679, LY T679, LG T679 LS T770, LO T770, LY T770, LG T770, LP T770 LB T773, LV T773, LT T773, LW T773 LH T774 LS E675, LA E675, LY E675, LS T675 LS T776, LA T776, LO T776, LY T776, LB T776 LHGB T686 LT T68C, LB T68C - Hyper Mini TOPLED® LB M676 - Mini TOPLED Santana® LG M470 LS M47K, LO M47K, LY M47K Source: http://www.osram.convergy.de/
MEM1 QMEM = SparkFun-IC-Memory:W25Q128JV: W25Q128JV - scottohair
R1 R7 R13 R14 R19 R21 = Octal:SPARKFUN-RESISTORS_10KOHM: 10kΩ resistor A resistor is a passive two-terminal electrical component that implements electrical resistance as a circuit element. Resistors act to reduce current flow, and, at the same time, act to lower voltage levels within circuits. - Wikipedia; PROD_ID: RES-00824
R2 R17 R18 = SparkFun-Resistors:10KOHM: 10kΩ resistor A resistor is a passive two-terminal electrical component that implements electrical resistance as a circuit element. Resistors act to reduce current flow, and, at the same time, act to lower voltage levels within circuits. - Wikipedia; PROD_ID: RES-00824
R3 R4 R8 R12 R20 = Octal:SPARKFUN-RESISTORS_10KOHM: 10kΩ resistor A resistor is a passive two-terminal electrical component that implements electrical resistance as a circuit element. Resistors act to reduce current flow, and, at the same time, act to lower voltage levels within circuits. - Wikipedia; PROD_ID: RES-00824; VALUE: 10k
R5 = scottohair Tantalum:47OHM-KTR10EZPJ470: 47ohm scottohair
R6 R9-R11 = scottohair Tantalum:0OHM: 0ohm scottohair
R15 R16 = scottohair Tantalum:10K: 10K resistor scottohair
S1-S50 = TL3315NF100Q:TL3315NF100Q: SWITCH TACTILE SPST-NO 0.05A 15V; AVAILABILITY: Unavailable; DESCRIPTION: TL3315 Series SPST 1 N Round Button J-Bend SMT Low Profile Tactile Switch; MF: E-Switch; MP: TL3315NF100Q; PACKAGE: None; PRICE: None
SUPPLY1 = SparkFun-PowerSymbols:2PT_GND_TIE: Dual Ground Supply Power supply symbol for connecting two grounds. SparkFun Products: SparkFun AutoDriver - Stepper Motor Driver <https://www.sparkfun.com/products/11611>
U1 = Octal:TPS61222DCKR; MANUFACTURER_PART_NUMBER: TPS61222DCKR; VENDOR: Texas Instruments
U2 = Octal:TLV75533PDBVR: 500mA Low-IQ Small-Size Low-Dropout (LDO) Regulator 5-SOT-23 -40 to 125; AVAILABILITY: Unavailable; DESCRIPTION: 500mA Low-IQ Small-Size Low-Dropout _LDO_ Regulator 5-SOT-23 -40 to 125; MF: Texas Instruments; MP: TLV75533PDBVR; PACKAGE: SOT-23 Texas Instruments; PRICE: None
U3 = Octal:BQ24092DGQR: 1A, Single-Input, Single Cell Li-Ion Battery Charger; AVAILABILITY: Unavailable; DESCRIPTION: 1A, Single-Input, Single-Cell Li-Ion Battery Charger with Operation Over JEITA and 10kO NTC 10-MSOP-PowerPAD -40 to 150; MF: Texas Instruments; MP: BQ24092DGQR; PACKAGE: MSOP-10 Texas Instruments; PRICE: None
U4 = Octal:SPBTLE-RF: Very low power module for Bluetooth Smart v4.1; AVAILABILITY: Unavailable; DESCRIPTION: Very low power module for Bluetooth Smart v4.1; MF: STMicroelectronics; MP: SPBTLE-RF; PACKAGE: SMD-11 STMicroelectronics; PRICE: None
U5 = Octal:STM32L476VGT6
U$2 = Octal:LS027B7DH01
U$3 U$4 = Octal:SHORT
Y1 = scottohair Tantalum:FOXSDLF/080-20; MANUFACTURER_PART_NUMBER: FOXSDLF08020; VENDOR: Fox
Y2 = Octal:NX3215SA-32.768K-EXS00A-MU0000: Crystals CRYSTAL 32.768KHZ 12.5PF SMD Source: Datasheet <https://media.digikey.com/pdf/Data Sheets/NDK PDFs/NX3215SA-32.768kHz-EXS00A-MU00003.pdf>; DESCRIPTION: Crystals CRYSTAL 32.768KHZ 12.5PF SMD; HEIGHT: 0.9mm; MANUFACTURER_NAME: NDK; MANUFACTURER_PART_NUMBER: NX3215SA-32.768K-EXS00A-MU00003; MOUSER_PART_NUMBER: 344-NX3215SA32.768K3; MOUSER_PRICE-STOCK: https://www.mouser.com/Search/Refine.aspx?Keyword=344-NX3215SA32.768K3

## Net classes
1 ground: width 0.203 mm, clearance 0.203 mm
2 power: width 0.203 mm
3 cap sense: width 0.178 mm, clearance 0.635 mm
4 linear regulators: width 1.27 mm, clearance 0.381 mm
5 diff pair: width 0.203 mm